# EAGLE design snc98_3x4_Switch-block (EAGLE 6.6.0)
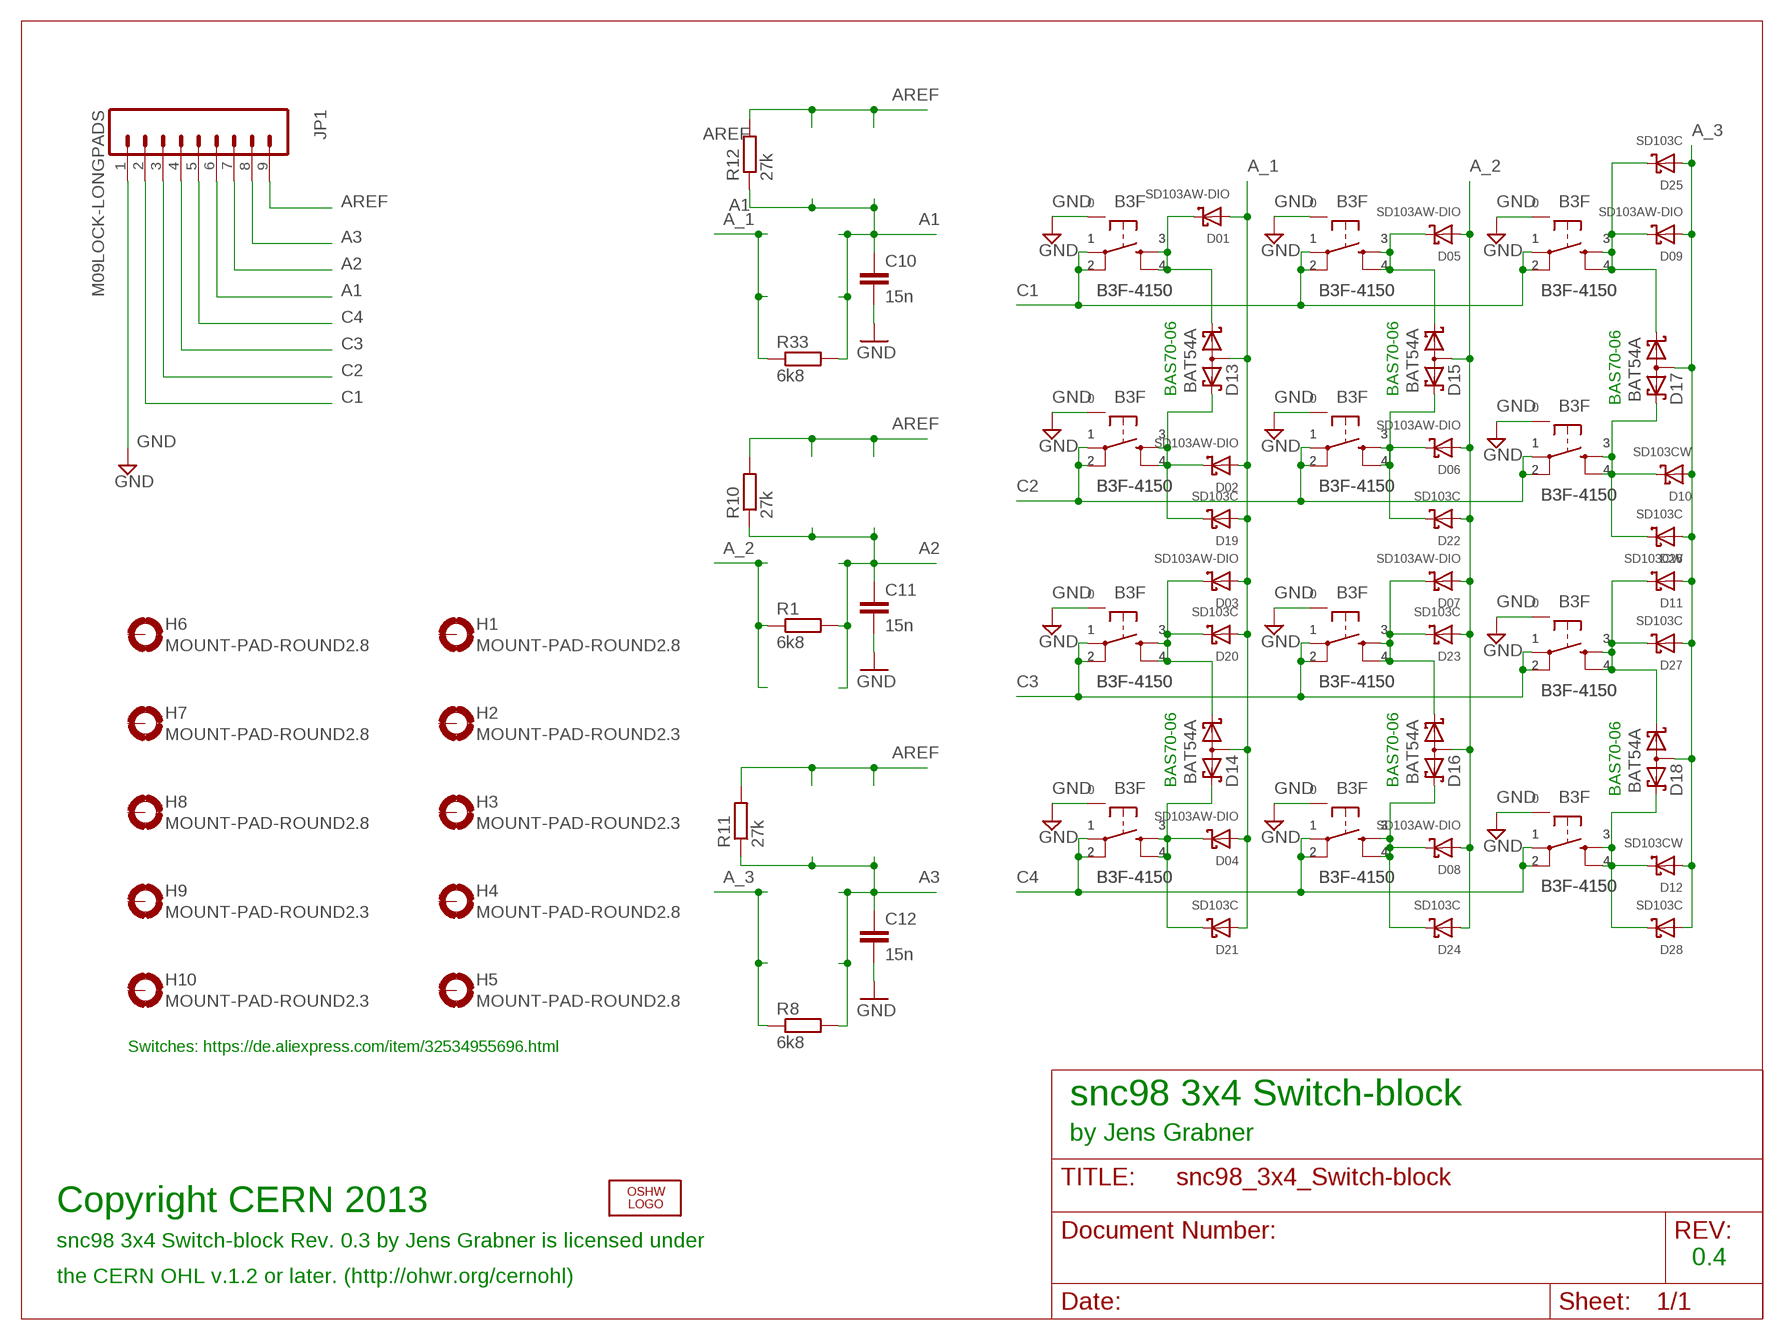
[diagram p0: schematic, sheet 1]

## Parts
C10  15n  C-EUC1206K  [C1206K]
C11  15n  C-EUC1206K  [C1206K]
C12  15n  C-EUC1206K  [C1206K]
D01  SD103AW-DIO  DIODESOD-123F  [SOD-123F]
D02  SD103AW-DIO  DIODESOD-123F  [SOD-123F]
D03  SD103AW-DIO  DIODESOD-123F  [SOD-123F]
D04  SD103AW-DIO  DIODESOD-123F  [SOD-123F]
D05  SD103AW-DIO  DIODESOD-123F  [SOD-123F]
D06  SD103AW-DIO  DIODESOD-123F  [SOD-123F]
D07  SD103AW-DIO  DIODESOD-123F  [SOD-123F]
D08  SD103AW-DIO  DIODESOD-123F  [SOD-123F]
D09  SD103AW-DIO  DIODESOD-123F  [SOD-123F]
D10  SD103CW  DIODESOD-123F  [SOD-123F]
D11  SD103CW  DIODESOD-123F  [SOD-123F]
D12  SD103CW  DIODESOD-123F  [SOD-123F]
D13  BAT54A  [SOT23]
D14  BAT54A  [SOT23]
D15  BAT54A  [SOT23]
D16  BAT54A  [SOT23]
D17  BAT54A  [SOT23]
D18  BAT54A  [SOT23]
D19  SD103C  DIODE280MIL-TH  [280MIL-TH]
D20  SD103C  DIODE280MIL-TH  [280MIL-TH]
D21  SD103C  DIODE280MIL-TH  [280MIL-TH]
D22  SD103C  DIODE280MIL-TH  [280MIL-TH]
D23  SD103C  DIODE280MIL-TH  [280MIL-TH]
D24  SD103C  DIODE280MIL-TH  [280MIL-TH]
D25  SD103C  DIODE280MIL-TH  [280MIL-TH]
D26  SD103C  DIODE280MIL-TH  [280MIL-TH]
D27  SD103C  DIODE280MIL-TH  [280MIL-TH]
D28  SD103C  DIODE280MIL-TH  [280MIL-TH]
H1  MOUNT-PAD-ROUND2.8  [2,8-PAD]
H2  MOUNT-PAD-ROUND2.3  [2,3-PAD]
H3  MOUNT-PAD-ROUND2.3  [2,3-PAD]
H4  MOUNT-PAD-ROUND2.8  [2,8-PAD]
H5  MOUNT-PAD-ROUND2.8  [2,8-PAD]
H6  MOUNT-PAD-ROUND2.8  [2,8-PAD]
H7  MOUNT-PAD-ROUND2.8  [2,8-PAD]
H8  MOUNT-PAD-ROUND2.8  [2,8-PAD]
H9  MOUNT-PAD-ROUND2.3  [2,3-PAD]
H10  MOUNT-PAD-ROUND2.3  [2,3-PAD]
JP1  M09LOCK-LONGPADS  [1X09_LOCK_LONGPADS]
LOGO1  OSHW_LOGO_8MILX0150-NT  [OSHW_8X150_NOTEXT]
R1  6k8  R-EU_M0805  [M0805]
R8  6k8  R-EU_M0805  [M0805]
R10  27k  R-EU_M0805  [M0805]
R11  27k  R-EU_M0805  [M0805]
R12  27k  R-EU_M0805  [M0805]
R33  6k8  R-EU_M0805  [M0805]
S1  B3F-4150  TACTILE_SWITCHTACTILE_SWITCH_PTH-12MM  [TACTILE-PTH-12MM]
S2  B3F-4150  TACTILE_SWITCHTACTILE_SWITCH_PTH-12MM  [TACTILE-PTH-12MM]
S3  B3F-4150  TACTILE_SWITCHTACTILE_SWITCH_PTH-12MM  [TACTILE-PTH-12MM]
S4  B3F-4150  TACTILE_SWITCHTACTILE_SWITCH_PTH-12MM  [TACTILE-PTH-12MM]
S5  B3F-4150  TACTILE_SWITCHTACTILE_SWITCH_PTH-12MM  [TACTILE-PTH-12MM]
S6  B3F-4150  TACTILE_SWITCHTACTILE_SWITCH_PTH-12MM  [TACTILE-PTH-12MM]
S7  B3F-4150  TACTILE_SWITCHTACTILE_SWITCH_PTH-12MM  [TACTILE-PTH-12MM]
S8  B3F-4150  TACTILE_SWITCHTACTILE_SWITCH_PTH-12MM  [TACTILE-PTH-12MM]
S9  B3F-4150  TACTILE_SWITCHTACTILE_SWITCH_PTH-12MM  [TACTILE-PTH-12MM]
S10  B3F-4150  TACTILE_SWITCHTACTILE_SWITCH_PTH-12MM  [TACTILE-PTH-12MM]
S11  B3F-4150  TACTILE_SWITCHTACTILE_SWITCH_PTH-12MM  [TACTILE-PTH-12MM]
S12  B3F-4150  TACTILE_SWITCHTACTILE_SWITCH_PTH-12MM  [TACTILE-PTH-12MM]

## Nets
A1: C10.1 JP1.6 R12.1 R33.2
A2: C11.1 JP1.7 R1.2 R10.1
A3: C12.1 JP1.8 R8.2 R11.1
A_1: D01.A D02.A D03.A D04.A D13.3(AA) D14.3(AA) D19.P$1(A) D20.P$1(A) D21.P$1(A) R33.1
A_2: D05.A D06.A D07.A D08.A D15.3(AA) D16.3(AA) D22.P$1(A) D23.P$1(A) D24.P$1(A) R1.1
A_3: D09.A D10.A D11.A D12.A D17.3(AA) D18.3(AA) D25.P$1(A) D26.P$1(A) D27.P$1(A) D28.P$1(A) R8.1
AREF: JP1.9 R10.2 R11.2 R12.2
C1: JP1.2 S1.P$1 S1.P$2 S1.P$11 S1.P$12 S1.P$21 S1.P$22 S5.P$1 S5.P$2 S5.P$11 S5.P$12 S5.P$21 S5.P$22 S9.P$1 S9.P$2 S9.P$11 S9.P$12 S9.P$21 S9.P$22
C2: JP1.3 S2.P$1 S2.P$2 S2.P$11 S2.P$12 S2.P$21 S2.P$22 S6.P$1 S6.P$2 S6.P$11 S6.P$12 S6.P$21 S6.P$22 S10.P$1 S10.P$2 S10.P$11 S10.P$12 S10.P$21 S10.P$22
C3: JP1.4 S3.P$1 S3.P$2 S3.P$11 S3.P$12 S3.P$21 S3.P$22 S7.P$1 S7.P$2 S7.P$11 S7.P$12 S7.P$21 S7.P$22 S11.P$1 S11.P$2 S11.P$11 S11.P$12 S11.P$21 S11.P$22
C4: JP1.5 S4.P$1 S4.P$2 S4.P$11 S4.P$12 S4.P$21 S4.P$22 S8.P$1 S8.P$2 S8.P$11 S8.P$12 S8.P$21 S8.P$22 S12.P$1 S12.P$2 S12.P$11 S12.P$12 S12.P$21 S12.P$22
GND: C10.2 C11.2 C12.2 JP1.1 S1.P$15 S2.P$15 S3.P$15 S4.P$15 S5.P$15 S6.P$15 S7.P$15 S8.P$15 S9.P$15 S10.P$15 S11.P$15 S12.P$15
N$2: D04.C D14.2(K2) D21.P$2(C) S4.P$3 S4.P$4 S4.P$13 S4.P$14 S4.P$23 S4.P$24
N$6: D01.C D13.1(K1) S1.P$3 S1.P$4 S1.P$13 S1.P$14 S1.P$23 S1.P$24
N$16: D09.C D17.1(K1) D25.P$2(C) S9.P$3 S9.P$4 S9.P$13 S9.P$14 S9.P$23 S9.P$24
N$18: D10.C D17.2(K2) D26.P$2(C) S10.P$3 S10.P$4 S10.P$13 S10.P$14 S10.P$23 S10.P$24
N$19: D02.C D13.2(K2) D19.P$2(C) S2.P$3 S2.P$4 S2.P$13 S2.P$14 S2.P$23 S2.P$24
N$21: D11.C D18.1(K1) D27.P$2(C) S11.P$3 S11.P$4 S11.P$13 S11.P$14 S11.P$23 S11.P$24
N$22: D12.C D18.2(K2) D28.P$2(C) S12.P$3 S12.P$4 S12.P$13 S12.P$14 S12.P$23 S12.P$24
N$24: D05.C D15.1(K1) S5.P$3 S5.P$4 S5.P$13 S5.P$14 S5.P$23 S5.P$24
N$25: D06.C D15.2(K2) D22.P$2(C) S6.P$3 S6.P$4 S6.P$13 S6.P$14 S6.P$23 S6.P$24
N$28: D07.C D16.1(K1) D23.P$2(C) S7.P$3 S7.P$4 S7.P$13 S7.P$14 S7.P$23 S7.P$24
N$30: D08.C D16.2(K2) D24.P$2(C) S8.P$3 S8.P$4 S8.P$13 S8.P$14 S8.P$23 S8.P$24
N$32: D03.C D14.1(K1) D20.P$2(C) S3.P$3 S3.P$4 S3.P$13 S3.P$14 S3.P$23 S3.P$24
Unconnected: H1.B2,8(MOUNT) H2.B2,8(MOUNT) H3.B2,8(MOUNT) H4.B2,8(MOUNT) H5.B2,8(MOUNT) H6.B2,8(MOUNT) H7.B2,8(MOUNT) H8.B2,8(MOUNT) H9.B2,8(MOUNT) H10.B2,8(MOUNT)

## Notes on the sheet
- BAS70-06 | BAS70-06
- BAS70-06
- BAS70-06 | BAS70-06
- BAS70-06
- Switches: https://de.aliexpress.com/item/32534955696.html
- snc98 3x4 Switch-block
- by Jens Grabner
- Copyright CERN 2013
- snc98 3x4 Switch-block Rev. 0.3 by Jens Grabner is licensed under
- 0.4
- the CERN OHL v.1.2 or later. (http://ohwr.org/cernohl)

## Library data of the parts
C10-C12 = rcl:C-EU: CAPACITOR, European symbol; OC_FARNELL: unknown; TME_EU: CC0805KRX7R9153
D01-D09 D10-D12 D19-D28 = BaseApp:DIODE; MF: MULTICOMP; MPN: SD103CW-7-F; OC_FARNELL: 2306221
D13-D18 = diode:BAT54A: Schottky Diodes Source: Fairchild .. BAT54.pdf; OC_FARNELL: unknown; TME_EU: BAT54A-DIO
H1-H10 = holes:MOUNT-PAD-ROUND: MOUNTING PAD, round; OC_FARNELL: unknown
JP1 = SparkFun-Connectors:M09: Header 9 Standard 9-pin 0.1" header. Use with straight break away headers (SKU : PRT-00116), right angle break away headers (PRT-00553), swiss pins (PRT-00743), machine pins (PRT-00117), and female headers (PRT-00115).; OC_FARNELL: unknown
LOGO1 = ohw-logo:OSHW_LOGO_8MIL; OC_FARNELL: unknown
R1 R8 R33 = rcl:R-EU_: RESISTOR, European symbol; OC_FARNELL: unknown; TME_EU: RC0805FR-076K8
R10-R12 = rcl:R-EU_: RESISTOR, European symbol; OC_FARNELL: unknown; TME_EU: RC0805FR-0727K
S1-S12 = SmartPrj:TACTILE_SWITCH: Momentary Switch Button commonly used for reset or general input.; OC_FARNELL: unknown; TME_EU: B3F-4050

## Net classes
0 default: clearance 0.205 mm

## Board
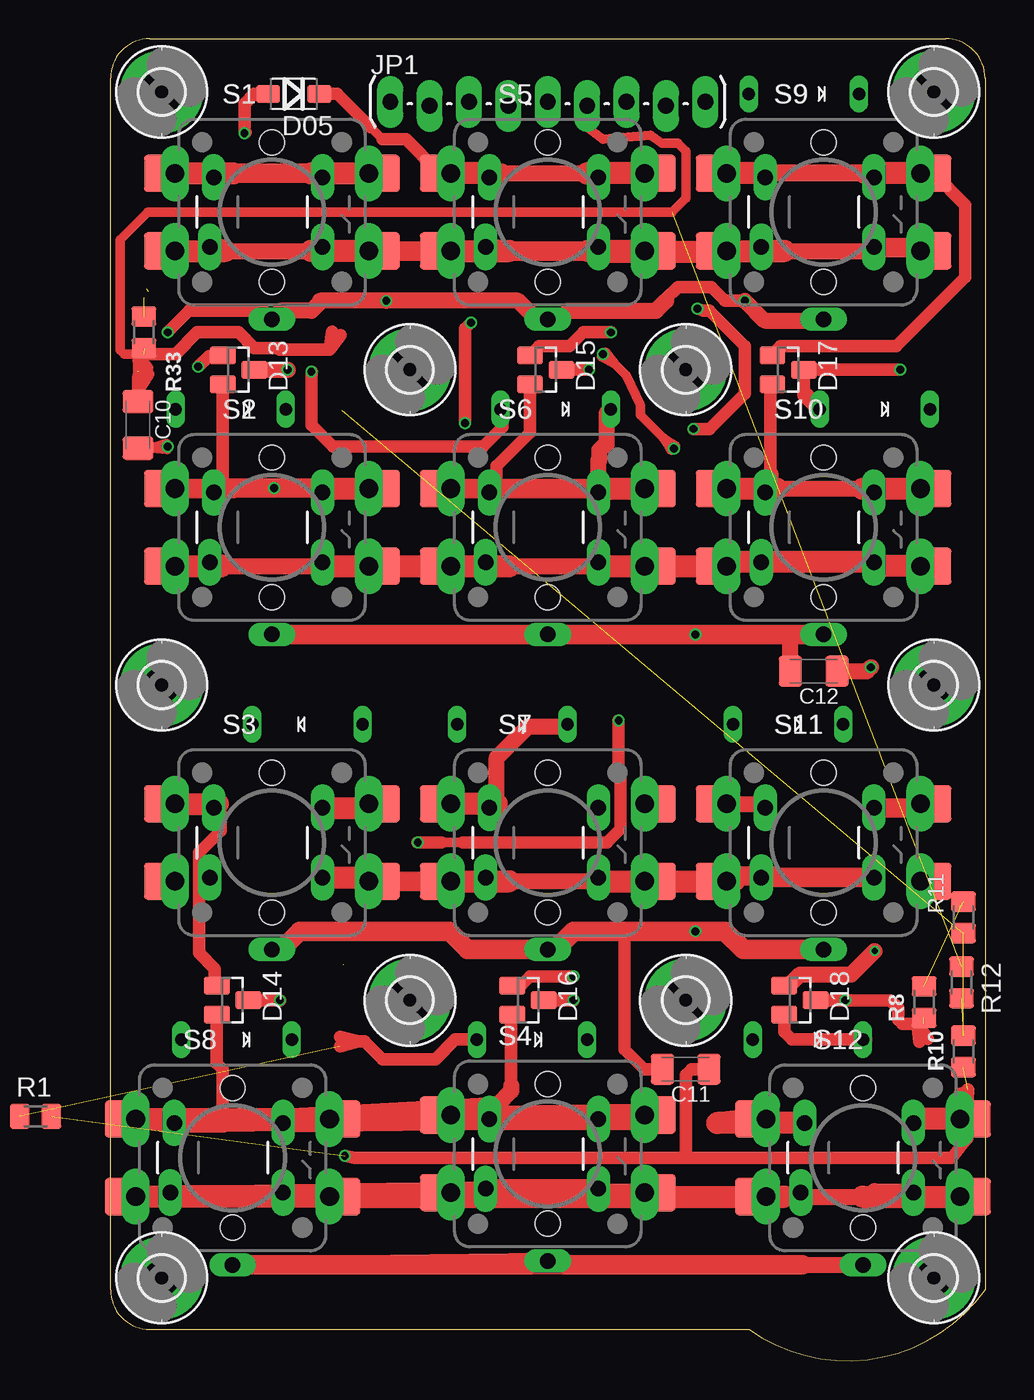
[diagram p1: board, top side]
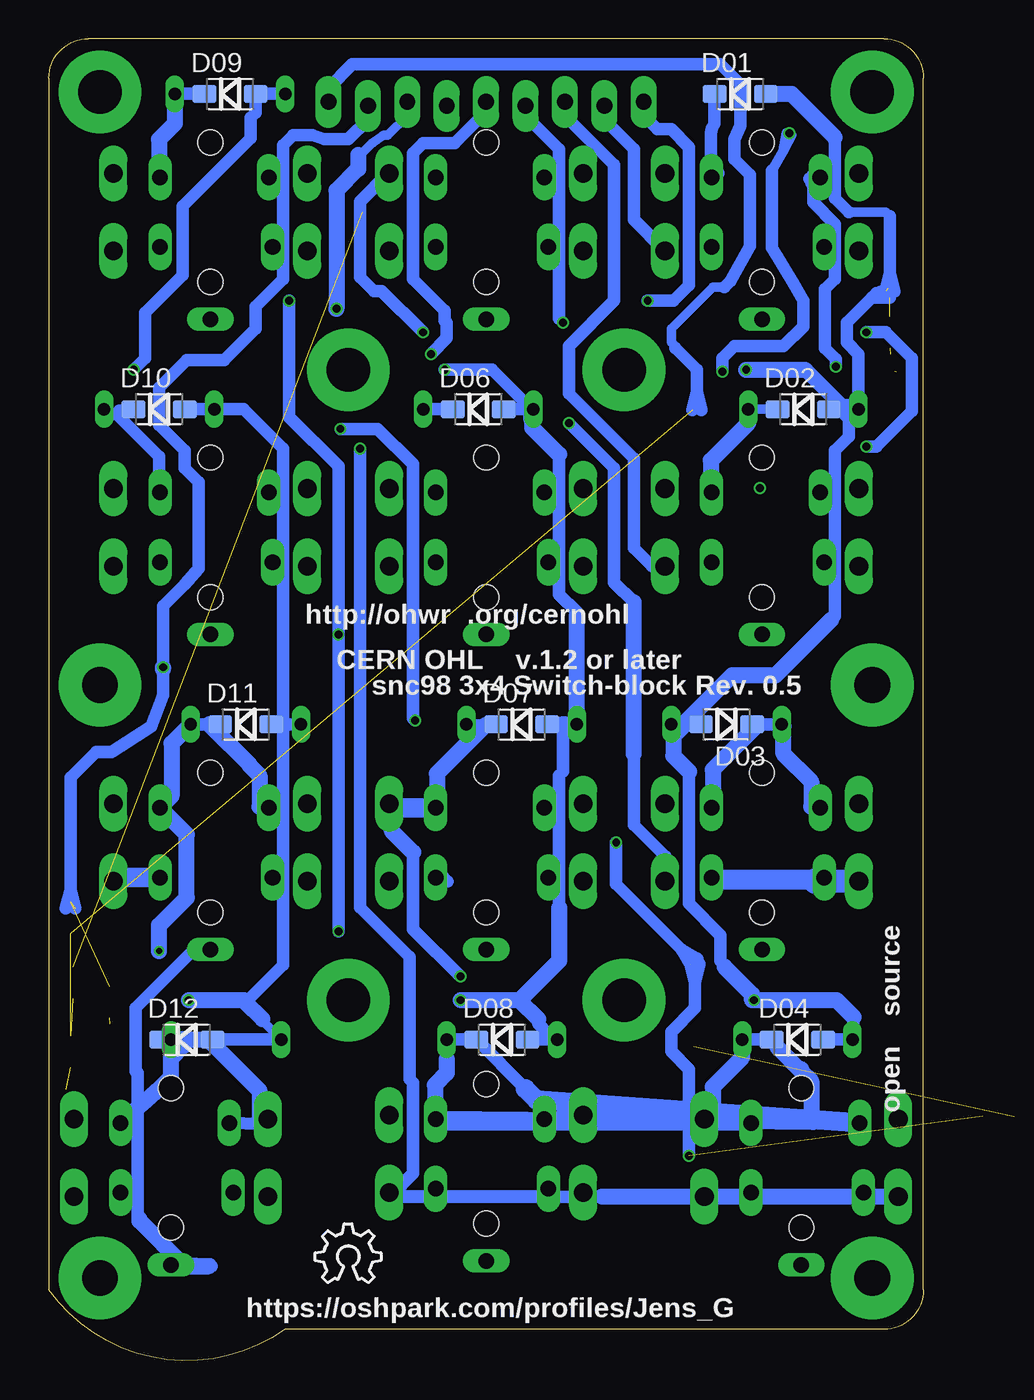
[diagram p2: board, bottom side, seen from below]

Size 56.39 x 85.22 mm. Coordinates in mm from the lower left corner, seen from the top.
Outline: 0,4.57 0,82.68 arc-90 2.54,85.22 53.85,85.22 arc-90 56.39,82.68 56.39,4.57 arc-90 41.15,2.03 2.54,2.03 arc-90 0,4.57
Copper layers (1*16): Top 0.035559375mm / dielectric 1.6mm / Bottom 0.035559375mm
Design rules "oshpark-2layer-tented": minimum track width 6mil, minimum drill 10mil, track to track 6mil, track to pad 6mil, pad to pad 6mil, via to via 6mil, smd to smd 6mil, copper to edge 15mil, drill to drill 6mil, minimum pad ring 5mil, minimum via ring 5mil, stop-mask expansion 2.5mil, vias tented up to drill 20mil, thermal gap 10mil

### Footprints (pad centres in the part's own frame; a part is rotated, then mirrored left to right if it is on the bottom)
C1206K = smd 1.5 x 2: 1 -1.5,0; 2 1.5,0
SOD-123F = smd 1.524 x 1.143: A 1.651,0; C -1.651,0
SOT23 = smd 1.143 x 1.651: 1 -0.94,-1.016; 2 0.94,-1.016; 3 0,1.016
280MIL-TH = drill 0.8 long: P$1 -3.556,0; P$2 3.556,0
2,8-PAD = drill 2.8 pad 5.334: B2,8 0,0
2,3-PAD = drill 2.3 pad 5.334: B2,8 0,0
1X09_LOCK_LONGPADS = drill 1.016 pad 1.676 long: 1 0,0.127; 2 2.54,-0.127; 3 5.08,0.127; 4 7.62,-0.127; 5 10.16,0.127; 6 12.7,-0.127; 7 15.24,0.127; 8 17.78,-0.127; 9 20.32,0.127
M0805 = smd 1.3 x 1.6: 1 -1.016,0; 2 1.016,0
TACTILE-PTH-12MM = smd 2.3 x 2.4: P$1 7.1,-2.5; P$2 -7.1,-2.5; P$3 7.1,2.5; P$4 -7.1,2.5 | drill 1.2 long: P$11 6.25,-2.5; P$12 -6.25,-2.5; P$13 6.25,2.5; P$14 -6.25,2.5 | drill 1 long: P$15 0,-6.9; P$21 3.251,-2.248; P$22 -4.013,-2.248; P$23 3.251,2.248; P$24 -3.759,2.248 | hole 1.6: 0,4.5; 0,-4.5; 0,4.5; 0,-4.5

### Placement (x,y rotation side)
C10  1.78,60.32 270 top
C11  37.08,18.8 180 top
C12  45.34,44.45 180 top
D01  11.81,81.66 0 bottom
D02  7.75,61.34 0 bottom
D03  12.7,41.02 180 bottom
D04  8.13,20.7 0 bottom
D05  11.81,81.66 180 top
D06  28.7,61.34 0 bottom
D07  25.91,41.02 0 bottom
D08  27.18,20.7 0 bottom
D09  44.7,81.66 0 bottom
D10  49.28,61.34 0 bottom
D11  43.69,41.02 0 bottom
D12  47.5,20.7 0 bottom
D13  8.26,63.88 270 top
D14  7.87,23.24 270 top
D15  28.07,63.88 270 top
D16  26.92,23.24 270 top
D17  43.69,63.88 270 top
D18  44.45,23.24 270 top
D19  7.75,61.34 0 top
D20  12.7,41.02 180 top
D21  8.13,20.7 0 top
D22  28.7,61.34 0 top
D23  25.91,41.02 0 top
D24  27.18,20.7 0 top
D25  44.7,81.66 0 top
D26  49.28,61.34 0 top
D27  43.69,41.02 0 top
D28  44.96,20.7 0 top
H1  3.3,81.79 0 top
H2  3.3,43.56 0 top
H3  3.3,5.33 0 top
H4  19.3,63.88 0 top
H5  19.3,23.24 0 top
H6  37.08,63.88 0 top
H7  37.08,23.24 0 top
H8  53.09,81.79 0 top
H9  53.09,43.56 0 top
H10  53.09,5.33 0 top
JP1  18.03,81.03 0 top
LOGO1  39.22,5.03 0 bottom
R1  -4.83,15.75 0 top  (outside the outline)
R8  52.45,23.11 90 top
R10  54.99,19.94 90 top
R11  54.99,28.57 270 top
R12  54.86,24.38 270 top
R33  2.16,66.29 270 top
S1  10.41,74.04 0 top
S2  10.41,53.72 0 top
S3  10.41,33.4 0 top
S4  28.19,13.33 0 top
S5  28.19,74.04 0 top
S6  28.19,53.72 0 top
S7  28.19,33.4 0 top
S8  7.87,13.08 0 top
S9  45.97,74.04 0 top
S10  45.97,53.72 0 top
S11  45.97,33.4 0 top
S12  48.51,13.08 0 top

### Tracks (layer width: path | path; a pad name or v marks a point on that pad's centre or on a via)
A1  (3 unrouted)
  Top 0.61: 1.65,64.9 0.89,64.9 0.64,65.15 0.64,72.26 2.41,74.04 36.2,74.04 37.08,74.93 37.08,77.98 36.58,78.49 35.56,78.49 34.8,78.99 31.75,78.74 30.73,79.5 JP1.6 | 1.74,64.9 2.13,64.9 | 1.74,64.9 1.75,63.75 | 1.74,64.9 2.47,64.01
  Top 0.813: C10.1 1.78,62.6 | 1.78,62.6 1.78,63.04 | 1.78,63.04 1.78,63.37 | 14.12,65.18 10.9,65.18 10.79,65.28 9.27,65.28 8.26,66.29 5.59,66.29 4.19,64.9 1.74,64.9 1.65,64.9 | 1.78,63.04 2.35,63.52 | 1.78,63.04 1.86,63.78 | 14.12,65.18 14.85,66.11 | 14.12,65.18 14.3,66.34 | 1.78,62.6 2.42,63.59 | 1.78,62.6 1.85,63.77
A2  (via drill 0.51)  (3 unrouted)
  Top 0.61: 22.73,33.4 21.34,33.4
  Top 0.813: 54.99,17.27 55.24,17.02 | 55.24,17.02 55.24,16.76 55.24,16.29 | 55.24,16.29 55.24,14.35 54.23,13.08 37.34,13.08 | 37.34,13.08 15.75,13.08 v15.11,13.21 | v37.85,67.82 38.23,67.69 38.61,67.69 40.89,65.4 40.89,62.36 38.61,60.07 v37.59,60.07 | 22.73,33.4 32,33.4 32.89,34.29 32.89,37.72 32.77,37.85 v32.77,41.27 | 21.34,33.4 v19.81,33.4 | C11.1 37.47,18.8 37.08,18.41 37.08,13.33 37.34,13.08 | 55.24,17.02 55.28,17.49 | 55.24,17.02 54.84,17.13 | 55.24,16.29 55.29,17.45 | 55.24,16.29 54.75,17.21
  Bottom 0.61: 36.45,77.72 36.32,77.72 35.56,78.49 34.8,78.99 34.54,78.99 33.27,80.26 JP1.7
  Bottom 0.813: v15.11,13.21 15.11,18.8 16.26,19.94 16.26,21.21 14.73,22.73 14.73,24.43 | 14.73,24.43 14.73,24.84 | v37.59,60.07 35.18,60.07 32.89,57.78 32.89,41.4 v32.77,41.27 | v19.81,33.4 19.81,30.73 15.59,26.52 | 15.59,26.52 15.31,26.23 | 14.73,24.84 15.02,25.54 | 14.73,24.84 14.45,25.54 | 15.31,26.23 14.61,25.93 | 15.31,26.23 15.01,25.53 | 14.73,24.43 15.03,25.58 | 14.73,24.43 14.44,25.58 | 15.59,26.52 14.58,25.92 | 15.59,26.52 14.99,25.5
  Bottom 1.016: 36.45,77.72 36.45,76.83 37.85,75.44 v37.85,67.82
A3  (via drill 0.51)  (2 unrouted)
  Top 1.016: C12.1 48.77,44.45 v49.02,44.7
  Bottom 0.813: v49.02,44.7 49.02,48.64 47.62,50.04 46.74,51.05 46.74,56.64 47.62,57.53 47.62,58.67 49.28,60.32 49.28,62.74 47.5,64.52 45.09,64.52 43.05,66.55 43.05,67.94 41.27,69.72 41.27,78.36 40.64,78.99 39.37,78.99 38.61,78.74 37.08,78.74 35.81,80.01 JP1.8 | 49.02,44.58 49.02,42.93 49.78,40.89 52.32,39.24 53.34,39.24 54.99,37.59 54.99,30.3 | 54.99,30.3 54.99,29.9 | 54.99,29.9 54.71,29.2 | 54.99,29.9 55.27,29.2 | 54.99,30.3 54.7,29.16 | 54.99,30.3 55.29,29.16
  Bottom 1.016: v49.02,44.7 49.02,44.58
A_1  (via drill 0.51)  (2 unrouted)
  Top 0.813: D14.3 v10.92,23.24
  Top 1.016: D13.3 v11.43,63.88
  Bottom 0.33: 15.24,41.02 15.49,40.89
  Bottom 0.61: 4.83,74.04 2.41,74.04 2.16,73.79 | D04.A 6.1,20.7 5.46,20.7
  Bottom 0.813: v10.92,23.24 11.05,23.24 | 4.51,61.47 5.33,61.47 5.46,61.59 | 5.46,61.59 7.75,63.88 | 5.71,78.87 5.71,74.93 4.83,74.04 | 2.16,73.79 2.16,70.05 | 2.16,70.05 2.16,69.65 | 7.62,63.88 7.49,63.88 5.21,61.59 4.57,61.59 4.19,61.98 4.19,64.9 4.95,65.66 4.95,66.93 3.34,68.54 | 3.34,68.54 3.05,68.83 2.97,68.83 | 12.83,25.4 12.83,25.53 13.08,25.78 13.08,27.43 15.11,29.46 15.11,37.97 | 2.16,69.65 1.88,68.95 | 2.16,69.65 2.44,68.95 | 2.97,68.83 2.27,69.12 | 2.97,68.83 2.27,68.55 | 2.16,70.05 1.86,68.91 | 2.16,70.05 2.45,68.91 | 3.34,68.54 2.3,69.1 | 3.34,68.54 2.16,68.53 | 4.83,60.71 4.83,59.56 5.71,58.67 5.71,48.01 5.97,47.75 | 4.83,60.71 D19.P$1 | D02.A 5.46,61.34 | 5.46,61.34 4.83,60.71 | D03.A 15.24,41.02 D20.P$1 | 4.51,22.16 4.51,20.76 D21.P$1 6.1,20.7 | 5.46,61.34 5.46,61.59
  Bottom 1.016: 4.51,22.16 5.59,23.24 v10.92,23.24 | 5.97,47.75 9.53,44.2 12.32,44.2 15.49,41.02 15.49,40.89 16.13,40.26 16.13,38.99 15.11,37.97 | 5.71,78.87 8.51,81.66 D01.A | v11.43,63.88 7.75,63.88 7.62,63.88 | 11.05,23.24 11.05,23.62 12.83,25.4
A_2  (via drill 0.51)  (1 unrouted)
  Top 0.813: D16.3 v29.84,23.24 | 8.7,79.18 v8.64,79.12 8.64,81.03 9.27,81.66 D05.A | v12.95,63.75 12.95,60.32 14.35,58.93 24,58.93 25.27,60.2 25.27,61.21 D22.P$1 | v30.86,63.88 D15.3 | D24.P$1 22.23,20.7 20.95,19.43 17.53,19.43 16.38,20.57 15.95,20.57 | 15.95,20.57 15.54,20.57 | 15.54,20.57 14.85,20.86 | 15.54,20.57 14.85,20.29 | 15.95,20.57 14.81,20.87 | 15.95,20.57 14.81,20.28
  Bottom 0.33: 22.35,41.15 D23.P$1 22.73,41.27 23.11,41.02
  Bottom 0.61: v8.64,79.12 8.64,78.93 8.93,78.16 | 8.93,78.16 9.78,76.71 | 8.93,78.16 8.84,79.15 v8.64,79.12 | 8.93,78.16 8.48,78.99 v8.64,79.12 | v8.64,79.12 8.83,79.17 9.06,77.94 8.47,79 v8.64,79.12 | D07.A 23.56,41.02 | D08.A 24.64,20.7 24.23,21.11
  Bottom 0.813: 9.78,76.71 9.78,71.75 8.38,69.47 7.75,68.33 7.75,66.67 9.02,65.4 12.19,65.4 12.95,64.64 v12.95,63.75 | 24.83,22.03 24.83,21.72 24.23,21.11 | 23.24,41.02 23.5,41.02 | 23.5,41.02 23.24,40.77 23.24,37.97 23.5,37.72 23.5,29.21 | 23.5,41.02 23.56,41.02 | v30.86,63.88 27.81,63.88 25.27,61.34 25.27,61.21 | 22.48,41.02 22.35,41.15 | 23.5,58.42 23.5,49.4 22.35,48.26 22.35,48.01 | D06.A D22.P$1 | D24.P$1 D08.A
  Bottom 1.016: 24.83,22.03 26.04,23.24 | 26.04,23.24 v29.84,23.24 | 23.24,41.02 23.11,41.02 | 22.35,41.15 22.35,48.01 | 23.5,58.42 25.21,60.13 25.21,60.64 25.27,60.71 25.27,61.21 D22.P$1 | 23.5,29.21 23.5,25.78 26.04,23.24
A_3  (via drill 0.51)  (1 unrouted)
  Top 0.813: D18.3 v47.37,23.24 50.29,23.24 50.8,22.73 50.8,21.97 51.05,21.72 52.03,21.72 | v50.93,63.88 D17.3 44.7,62.36 44.9,62.17 | 52.03,21.72 52.43,21.72 | 52.03,21.72 52.15,20.54 | 52.03,21.72 52.7,20.75
  Top 1.016: 44.79,62.27 44.9,62.17 D26.P$1
  Bottom 0.61: 42.61,22.03 42.61,21.91 D28.P$1 | D11.A 41.27,41.02
  Bottom 0.813: 41.27,41.02 41.27,25.53 43.69,23.11 | 41.27,41.02 41.27,58.8 43.81,61.34 D26.P$1 D10.A | v50.93,63.88 50.16,64.64 50.16,67.56 47.75,69.98 47.75,74.42 43.37,78.8 43.37,80.14 43.05,80.45 D09.A D25.P$1 | D12.A D28.P$1 | 41.27,41.02 D27.P$1
  Bottom 1.016: 42.61,22.03 43.69,23.11 43.81,23.24 v47.37,23.24
AREF  (3 unrouted)
  Bottom 0.61: 16,65.28 16,65.4 16.26,65.66 16.26,66.55 13.59,69.21 12.83,69.21
  Bottom 0.813: 14.61,62.03 14.61,62.43 | 14.61,62.43 14.61,63.88 16,65.28 | 12.83,69.21 12.45,69.6 11.18,71.84 11.18,76.45 12.19,77.47 12.19,78.74 11.81,79.63 11.81,82.3 13.08,83.57 36.83,83.57 38.35,82.04 JP1.9 | 14.61,62.03 14.32,61.33 | 14.61,62.03 14.89,61.33 | 14.61,62.43 14.31,61.29 | 14.61,62.43 14.9,61.29
C1
  Top 0.813: 31.2,71.54 31.24,71.5 | S1.P$21 13.46,71.79 13.21,71.54 | 24.93,71.75 24.93,71.78 S5.P$22 | 31.62,71.5 31.45,71.68 S5.P$21 | S9.P$12 S9.P$2 | S9.P$11 S9.P$1
  Top 1.016: 12.91,71.54 7.41,71.54 7.16,71.78 S1.P$22 | 43.47,71.54 48.97,71.54 S9.P$21 | 24.89,71.75 24.93,71.75 25.15,71.54 | 42.8,71.54 42.8,71.72 S9.P$22
  Top 1.27: S1.P$1 S5.P$2 S5.P$12 | S9.P$21 49.26,71.75 52.86,71.75 S9.P$1 | 25.69,71.54 30.99,71.54
  Top 1.422: S1.P$2 S1.P$12 7.41,71.54 | S5.P$12 25.15,71.54 25.69,71.54 | S5.P$1 34.5,71.54 | 34.5,71.54 S5.P$11 31.2,71.54 30.99,71.54 30.77,71.54 | 31.62,71.5 34.54,71.5 | 34.54,71.5 38.83,71.5 S9.P$2 | S9.P$12 42.8,71.54 43.47,71.54 | 53.03,71.5 S9.P$1 | 34.5,71.54 34.54,71.5 | S1.P$1 S1.P$11 13.21,71.54 12.91,71.54
  Bottom 0.813: S1.P$11 18.67,73.55 18.67,78.1 20.57,80.01 JP1.2 20.57,81.03
C2
  Top 1.016: 13.42,51.22 7.15,51.22 7.15,51.46 S2.P$22 | 25.69,51.22 31.2,51.22 31.2,51.23 S6.P$21 | 39.13,51.47 39.47,51.47 S10.P$12
  Top 1.27: 25.69,51.22 25.2,51.22 S6.P$22 | 13.42,51.22 13.41,51.22 S2.P$21
  Top 1.422: S2.P$12 4.1,51.22 4.06,51.18 3.35,51.18 S2.P$2 7.15,51.22 | 13.42,51.22 S2.P$11 S2.P$1 S6.P$2 S6.P$12 25.69,51.22 | 31.2,51.22 S6.P$11 S6.P$1 S10.P$2 39.13,51.47 S10.P$22 S10.P$21 49.48,51.22 S10.P$11 S10.P$1
  Bottom 0.813: 16.51,51.22 S2.P$11 S2.P$1 18.67,52.38 18.67,58.17 22.86,62.36 22.86,65.4 19.94,68.33 19.94,77.09 23.11,80.26 JP1.3
C3  (via drill 0.51)
  Top 0.813: v23.24,66.93 22.86,66.55 v22.86,60.45 | 25.69,30.9 25.2,30.9 S7.P$22 | S3.P$12 4.32,30.75 4.32,30.73 3.48,30.73 S3.P$2
  Top 1.016: 25.69,30.9 31.2,30.9 31.2,30.91 S7.P$21 | 4.16,30.89 4.32,30.73 | 4.32,30.73 4.32,30.86 4.19,30.99 4.06,30.99 | 4.06,30.99 3.94,30.86 4.06,30.86 4.06,30.99 | 4.06,30.99 3.4,30.99 S3.P$2 | 4.32,30.73 3.81,30.73 3.68,30.86 | 49.19,31.11 S11.P$21 | 40.3,30.9 40.26,30.86 39.75,30.86 39.72,30.89 S11.P$12 | S11.P$1 S11.P$11
  Top 1.27: S11.P$2 S11.P$12 | 40.3,30.9 40.64,31.24 42.63,31.24 S11.P$22 S11.P$21 | S3.P$11 S3.P$1 20.28,30.9 20.45,30.73 20.93,30.73 S7.P$2
  Top 1.422: S7.P$2 S7.P$12 25.69,30.9 | 31.2,30.9 S7.P$11 S7.P$1 S11.P$2 | S3.P$21 16.41,31.15 S3.P$11 | S3.P$11 16.66,30.58 17.02,30.23 17.02,30.55 S3.P$11
  Bottom 0.813: 18.67,48.89 19.94,50.16 19.94,57.53 v22.86,60.45 | v23.24,66.93 23.5,67.18 23.5,78.1 25.65,80.26 JP1.4 | 18.67,39.12 18.67,34.54 16.64,32.51 16.64,30.93 S3.P$11 | S7.P$21 30.95,31.15 30.69,30.9 | 4.32,30.73 6.35,30.73 6.86,31.24 | 6.86,31.24 13.72,31.24 | 6.86,31.24 4.83,31.24 4.32,30.73 | 4.32,30.73 4.32,30.75 S3.P$12
  Bottom 1.016: 18.67,39.12 18.67,48.89 | S3.P$22 7.42,30.9 13.41,30.9 S3.P$21
  Bottom 1.27: 49.19,31.11 S11.P$21 51.97,31.15 S11.P$11
  Bottom 1.422: 6.91,30.9 4.49,30.9 4.32,30.73
  Bottom 1.676: 6.91,30.9 S3.P$22
C4  (via drill 0.51)
  Top 0.61: v31.75,64.9 31.88,64.9 32.35,64.42 | 32.35,64.42 32.53,64.24 | 32.53,64.24 33.27,63.5 34.16,61.59 34.16,60.96 35.6,59.52 | 35.6,59.52 35.78,59.34 | 35.78,59.34 v36.32,58.8 | 32.35,64.42 31.91,65.02 v31.75,64.9 | 32.35,64.42 31.67,64.71 v31.75,64.9 | 35.78,59.34 36.15,58.7 v36.32,58.8 | 35.78,59.34 36.42,58.98 v36.32,58.8 | 32.53,64.24 31.91,65.02 v31.75,64.9 | 32.53,64.24 31.65,64.72 v31.75,64.9 | 35.6,59.52 36.15,58.69 v36.32,58.8 | 35.6,59.52 36.43,58.97 v36.32,58.8
  Top 0.813: S8.P$2 21.8,10.58 21.84,10.54 | S4.P$21 13.66,10.78 13.46,10.58 | S8.P$12 S8.P$11 21.97,10.58 22.23,10.83 | S12.P$12 42.47,10.58 S12.P$22
  Top 1.016: 13.46,10.58 S4.P$11 | S8.P$12 31.19,10.58 | 43.47,10.58 48.47,10.58 | 31.46,10.58 31.19,10.58 | 31.19,10.58 S8.P$21 | S8.P$22 22.1,10.83 | 22.23,10.83 22.1,10.83 | 22.1,10.83 21.84,10.58 | 42.67,10.79 42.97,10.79 43.18,10.58 | S12.P$21 49.23,10.87 49.28,10.92 | 7.15,10.58 7.15,10.82 S4.P$22
  Top 1.27: S4.P$1 S8.P$2 | S4.P$22 S4.P$21 | 49.28,10.58 49.28,10.78 S12.P$21
  Top 1.422: S4.P$2 S4.P$12 7.15,10.58 | S4.P$1 S4.P$11 | S8.P$2 S8.P$12 21.84,10.58 | 31.46,10.58 S8.P$11 S8.P$1 | S8.P$1 34.5,10.58 34.54,10.54 35.25,10.54 S8.P$1 | S8.P$1 S12.P$2 S12.P$12 43.18,10.58 43.47,10.58 | 48.47,10.58 49.28,10.58 S12.P$11 S12.P$1
  Bottom 0.813: v36.32,58.8 36.32,29.21 33.15,26.03 33.15,18.16 32.89,17.91 32.89,12.06 34.29,10.67 34.42,10.67 | v31.75,64.9 30.73,65.91 30.73,66.93 30.86,67.06 30.86,67.69 32.89,69.72 32.89,77.85 32.26,78.49 30.23,78.49 28.19,80.52 JP1.5 | 34.42,10.67 34.45,10.67 34.53,10.58 S8.P$11 | S8.P$11 34.29,10.58 | S8.P$11 34.44,10.64 34.42,10.67
  Bottom 1.016: S8.P$12 20.7,10.58
GND  (via drill 0.51)
  Top 0.61: C10.2 2.67,58.82 | 2.67,58.82 2.93,58.82 | 2.93,58.82 3.58,58.82 v3.68,58.93 | 2.93,58.82 3.66,58.73 v3.68,58.93 | 2.93,58.82 3.6,59.11 v3.68,58.93 | 2.67,58.82 3.66,58.73 v3.68,58.93 | 2.67,58.82 3.62,59.12 v3.68,58.93
  Top 0.813: S5.P$15 28.91,67.14 29.46,67.69 | 39.62,27.69 38.1,27.69 37.97,27.81 37.85,27.81 v37.72,27.69 | v3.68,66.29 5.08,67.69 9.86,67.69 S1.P$15 | 35.81,68.33 35.81,68.45 36.58,69.21 38.73,69.21 39.62,68.33 v40.89,68.33 | C11.2 34.42,18.8 33.15,20.07 33.15,27.69
  Top 1.016: 35.81,68.33 35.18,67.69 29.46,67.69 | v40.89,68.33 42.16,67.06 45.89,67.06 S9.P$15 | 28.11,67.14 S5.P$15 28.11,67.06 27.56,67.06 26.29,68.33 v17.78,68.33 13.5,68.33 13.5,68.24 12.95,67.69 10.96,67.69 S1.P$15 | C12.2 43.84,46.54 43.56,46.82 | S4.P$15 S8.P$15 | 44.62,6.18 S12.P$15
  Top 1.27: S8.P$15 44.62,6.18 | S11.P$15 40.81,26.5 39.62,27.69 v37.72,27.69 33.15,27.69 29.84,27.69 28.57,26.42 28.28,26.42 S7.P$15 23.03,26.5 21.84,27.69 12.19,27.69 10.92,26.42 10.5,26.42 S3.P$15 | S2.P$15 S6.P$15 v37.72,46.82 43.56,46.82 S10.P$15
  Bottom 0.813: v40.89,68.33 40.89,60.83 37.72,57.66 v37.72,46.82 v37.72,27.69 | 45.97,6.22 46.02,6.22 S12.P$15 45.89,6.1 | S11.P$15 46.02,26.54 46.99,26.54 50.8,22.73 50.8,18.67 50.67,18.54 50.67,9.27 50.55,9.14 | v3.68,58.93 3.05,58.93 0.76,61.21 0.76,64.64 2.41,66.29 v3.68,66.29 | v17.78,68.33 16.13,68.33 15.11,69.34 15.11,78.23 16.26,79.37 17.14,79.37 18.03,80.26 JP1.1
  Bottom 1.016: 50.55,9.14 50.55,9.02 47.62,6.1 46.06,6.1 S12.P$15
N$2
  Top 0.813: D14.2 6.86,19.18 7.24,18.8 7.24,15.4 S4.P$24 | S4.P$14 4.16,15.43 4.19,15.4
  Top 1.016: 14.44,15.58 13.92,15.58 S4.P$23
  Top 1.422: S4.P$3 17.47,15.62 16.76,15.62 16.72,15.58 S4.P$13 14.44,15.58 | 7.24,15.4 4.19,15.4 3.49,15.4 S4.P$4
  Bottom 0.61: 9.66,20.29 9.66,20.33 9.91,20.57 9.65,20.57 D04.C 9.65,20.57 9.53,20.57
  Bottom 0.813: 7.87,18.8 9.24,20.16 9.37,20.16 9.53,20.16 9.53,20.57 | 11.68,20.51 D21.P$2 D04.C
  Bottom 1.016: 11.68,20.51 11.68,19.56 13.59,17.65 13.59,15.4 S4.P$23 | 9.37,20.16 7.87,18.67 | 7.87,18.8 7.87,18.67 | 7.87,18.67 7.24,18.03 7.24,15.71 7.11,15.58 7.11,15.38 S4.P$24
N$6  (via drill 0.51)
  Top 0.61: v5.65,64.07 5.59,64.01
  Top 0.813: v5.65,64.07 6.35,64.77 7.19,64.77 D13.1
  Top 1.016: 7.91,76.54 7.42,76.54 S1.P$24 | 12.91,76.54 13.41,76.54 S1.P$23
  Top 1.27: 12.91,76.54 7.91,76.54
  Top 1.422: 12.91,76.54 S1.P$13 16.7,76.58 16.76,76.58 16.8,76.54 S1.P$3 | S1.P$4 S1.P$14 7.91,76.54
  Bottom 0.813: v5.65,64.07 5.65,64.58 6.35,65.28 6.35,69.09 5.71,69.72 5.71,73.28 7.11,74.68 7.11,75.95 7.37,76.2 7.11,76.2 7.11,76.45 7.16,76.4 S1.P$24 | 13.46,76.54 13.21,76.54 13.46,76.29 S1.P$23 13.72,76.34 13.72,79.12 13.65,79.44 13.46,79.76 D01.C
  Bottom 1.016: 7.11,75.95 7.11,76.24 | S1.P$23 13.72,76.33
N$16
  Top 0.813: S9.P$23 48.51,76.29 48.26,76.54 | S9.P$13 S9.P$3 55.12,74.5 55.12,69.85 50.67,65.4 43.18,65.4 42.67,64.9 D17.1
  Top 1.016: 48.47,76.54 48.26,76.54 42.98,76.54 S9.P$24 43.02,76.58 | 43.02,76.58 39.76,76.58 | 43.02,76.58 49.52,76.58 S9.P$23
  Top 1.422: S9.P$4 S9.P$14 39.76,76.58 42.43,76.58 S9.P$24 | 49.52,76.58 52.18,76.58 S9.P$13
  Bottom 0.813: D09.C D25.P$2
  Bottom 1.016: D25.P$2 48.26,79.76 49.28,78.74 49.28,76.34 S9.P$23
N$18
  Top 0.813: 42.55,57.15 42.55,62.63 42.67,62.76 D17.2 | 48.47,56.22 48.97,56.22 S10.P$23
  Top 1.016: 42.97,56.22 48.47,56.22 | 42.55,57.15 42.55,56.15 S10.P$24 42.72,56.14 42.8,56.22
  Top 1.27: 48.51,56.26 48.47,56.22
  Top 1.422: S10.P$4 38.91,56.26 39.62,56.26 39.66,56.22 S10.P$14 42.8,56.22 42.97,56.22 | 48.47,56.22 S10.P$13 S10.P$3
  Bottom 0.61: D10.C 51.88,61.34 52.2,61.02
  Bottom 0.813: S10.P$23 49.28,56.02 49.28,58.29 52.01,61.02 52.2,61.02 52.51,61.02 D26.P$2
N$19  (via drill 0.51)
  Top 0.813: D13.2 7.24,56.04 S2.P$24 | 7.87,56.26 7.91,56.22
  Top 1.27: S2.P$4 S2.P$14 7.91,56.22 7.95,56.26 v10.54,56.26 13.37,56.26 S2.P$23 13.41,56.22 13.68,56.22 | 7.87,56.26 7.46,56.26 S2.P$24
  Top 1.422: 13.68,56.22 S2.P$13 S2.P$3
  Bottom 0.33: D19.P$2 11.3,61.15
  Bottom 0.61: D02.C D19.P$2
  Bottom 1.016: S2.P$23 13.72,56.02 13.72,58.04 11.3,60.45 11.3,61.15
N$21  (via drill 0.41)
  Top 1.016: D18.1 43.74,24.18 44.45,24.89 47.75,24.89 v49.28,26.42 | S11.P$24 42.47,35.9 S11.P$14 S11.P$4 | S11.P$13 S11.P$3
  Top 1.27: S11.P$23 52.82,35.65 S11.P$3
  Bottom 0.61: D11.C 45.72,41.02 45.88,40.86
  Bottom 0.813: 46.04,41.02 D27.P$2
  Bottom 1.016: D27.P$2 48.47,39.79 48.47,36.4 S11.P$23 47.5,33.92 47.5,29.84 49.28,28.07 v49.28,26.42 | 46.04,41.02 45.88,40.86 43.47,38.46 43.47,38.39 42.8,37.72 42.8,35.72 S11.P$24
N$22
  Top 0.813: 48.32,20.7 43.94,20.7 43.43,21.21 D18.2
  Top 1.016: 39.13,15.33 39.47,15.33 S12.P$14
  Top 1.27: S12.P$23 52.03,15.33 52.28,15.58 S12.P$3 | D28.P$2 48.32,20.7
  Top 1.422: S12.P$13 52.28,15.58 | S12.P$24 39.13,15.33 S12.P$4
  Bottom 0.33: 47.24,20.7 47.5,20.7 47.72,20.29
  Bottom 0.813: 47.72,20.29 48.13,20.7 D28.P$2 | S12.P$24 42.77,15.28
  Bottom 1.016: 47.24,20.7 D12.C 46.1,20.7 42.8,17.4 42.8,15.28 42.77,15.28 | 47.72,20.29 48.51,19.49 48.51,18.29 49.23,17.58 S12.P$23
N$24  (via drill 0.51)
  Top 0.61: 17.53,78.74 16.76,79.5
  Top 0.813: S5.P$4 21.09,76.7 19.05,78.74 17.53,78.74 | v32.26,66.29 30.48,66.29 29.59,65.4 27.64,65.4 D15.1 | 16.76,79.5 14.61,81.66 D05.C
  Top 1.016: 24.93,76.54 30.69,76.54 30.95,76.29 S5.P$23
  Top 1.27: 24.93,76.54 25.2,76.54 S5.P$24
  Top 1.422: S5.P$3 35.25,76.58 34.54,76.58 34.5,76.54 S5.P$13 30.69,76.54 | 24.93,76.54 S5.P$14 21.9,76.58 21.84,76.58 21.8,76.54 S5.P$4
  Bottom 0.813: v32.26,66.29 34.92,68.96 35.43,68.96 36.32,69.85 36.32,74.72 34.5,76.54
  Bottom 1.016: 34.5,76.54 S5.P$13
N$25
  Top 0.813: 25.91,56.26 25.78,56.26 | 25.78,56.26 25.78,56.13 25.69,56.22 | 25.73,56.26 25.65,56.26 25.69,56.22 | 25.78,56.26 25.73,56.26 | 25.73,56.26 25.69,56.22 | D15.2 27.05,59.82 24.89,57.66 24.89,56.01
  Top 1.016: D22.P$2 32,61.09 32,59.05 31.88,59.05 31.5,58.67 31.5,58.04 31.46,58 31.46,56.22 S6.P$23 | S6.P$13 35.27,56.22 | 35.27,56.22 35.31,56.26 | 35.31,56.26 34.54,56.26 34.54,56.13 35.18,56.13 35.27,56.22 | S6.P$3 35.47,56.22 35.69,56.01 35.56,56.01 35.31,56.26 | 25.65,56.26 25.15,56.26 24.89,56.01
  Top 1.27: S6.P$14 25.2,56.22 | 31.46,56.22 25.69,56.22 25.2,56.22 | 25.2,56.22 S6.P$24
  Top 1.422: S6.P$14 21.88,56.22 21.84,56.26 21.13,56.26 S6.P$4 | 31.46,56.22 S6.P$13 S6.P$3
  Bottom 0.813: D06.C D22.P$2
N$28  (via drill 0.51)
  Top 0.813: v29.84,24.76 27.05,24.76 26.47,24.18 D16.1
  Top 1.016: 24.89,35.9 24.89,38.86 26.92,40.89 29.15,40.89 29.27,41.02 D23.P$2 | S7.P$13 S7.P$3
  Top 1.27: S7.P$3 34.88,35.9 34.54,35.56 | 24.89,35.9 24.89,35.7 S7.P$24
  Top 1.422: 24.89,35.9 S7.P$14 | S7.P$14 21.88,35.9 | 21.88,35.9 21.84,35.94 21.9,35.94 S7.P$14 | S7.P$4 21.88,35.9
  Bottom 0.33: D23.P$2 29.21,40.96
  Bottom 0.61: D07.C D23.P$2
  Bottom 0.813: 28.26,40.96 29.21,40.96 | 32.89,32.77 32.89,27.81 v29.84,24.76 | 34.54,35.8 S7.P$13
  Bottom 1.016: 28.26,40.96 31.37,37.85 31.37,35.72 S7.P$23 | 34.4,35.94 S7.P$13 | 32.89,32.77 34.29,34.16 34.29,35.39 34.04,35.65 | 34.54,34.8 34.54,35.56 34.54,35.8
  Bottom 1.27: S7.P$23 34.04,35.65 34.39,35.65 | 34.39,35.65 34.54,35.8 | 34.39,35.65 34.45,35.65 34.54,35.56
N$30
  Top 0.813: 25.82,17.74 25.82,22.22 D16.2
  Top 1.016: 25.82,17.74 25.82,17.39 24.94,16.51 S8.P$24
  Top 1.27: S8.P$14 24.69,15.58 S8.P$24 | 33.23,15.58 31.7,15.58 S8.P$23
  Top 1.422: 21.84,15.62 21.88,15.58 S8.P$14 S8.P$4 | 33.23,15.58 33.27,15.62 34.4,15.62 S8.P$13 34.48,15.62 34.54,15.62 34.58,15.58 S8.P$3
  Bottom 0.61: 30.73,19.43 30.73,20.07
  Bottom 0.813: D08.C 25.65,17.53 | D24.P$2 30.86,20.57 30.86,20.19 30.8,20.13 30.8,20.76 30.73,20.83 30.48,20.83 | 30.73,20.07 D24.P$2 | 29.21,20.7 D24.P$2
  Bottom 1.016: 29.21,20.7 D08.C | 30.73,19.43 30.73,18.54 31.5,17.78 31.5,15.38 S8.P$23
  Bottom 1.27: S8.P$24 24.94,16.81 25.65,17.53
N$32
  Top 0.813: D14.1 6.78,24.18 6.73,24.23 6.73,25.27 5.71,26.29 5.71,32.77 7.11,34.16 7.11,35.27 6.48,35.9
  Top 1.016: 16.72,35.9 S3.P$13
  Top 1.422: 16.72,35.9 16.76,35.94 | S3.P$3 16.72,35.9 | S3.P$4 S3.P$14 6.48,35.9 6.91,35.9 S3.P$24 | S3.P$23 16.47,35.65 16.72,35.9
  Bottom 0.61: 11.17,41.01 10.92,40.77
  Bottom 0.813: D20.P$2 10.54,41.02 10.79,40.77 10.92,40.77 | D03.C 11.16,41.02 11.17,41.01
  Bottom 1.016: 10.92,40.77 13.59,38.1 13.59,35.72 S3.P$23 | D20.P$2 9.02,40.89 9.02,39.12 7.24,37.34 7.24,35.72 S3.P$24

### Text on the board
bPlace: http://ohwr .org/cernohl | CERN OHL v.1.2 or later | snc98 3x4 Switch-block Rev. 0.5 | source | open | https://oshpark.com/profiles/Jens_G